# EAGLE design obstacle_avoiding_robot (EAGLE 6.1)
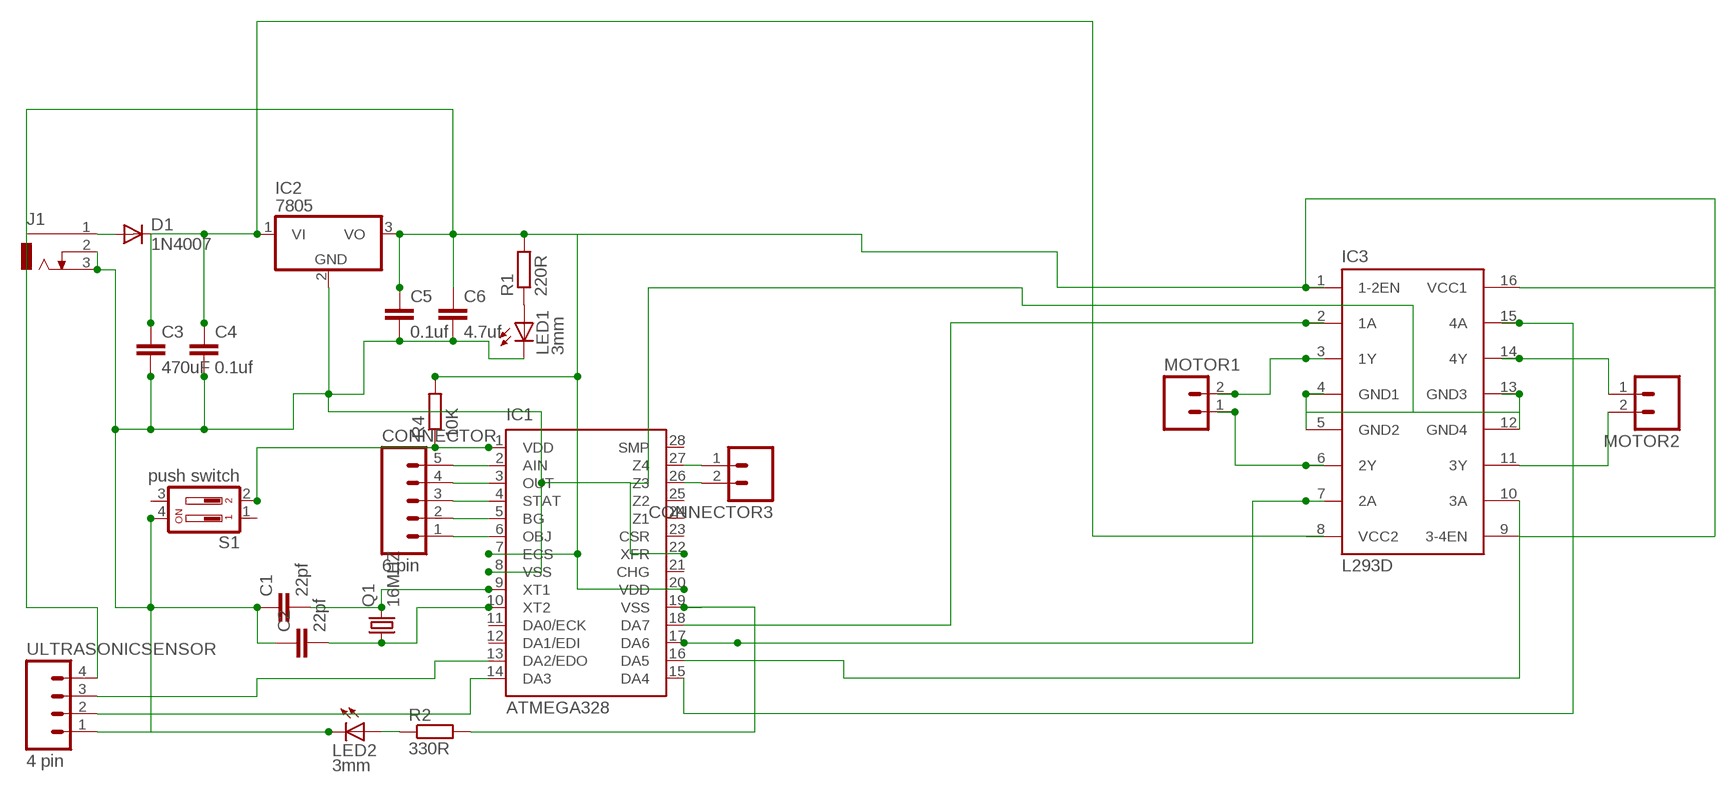
[diagram p0: schematic, sheet 1]

## Parts
C1  22pf  C2.5/2  [C2.5-2]
C2  22pf  C2.5/2  [C2.5-2]
C3  470uF  C2.5/2  [C2.5-2]
C4  0.1uf  C2.5/2  [C2.5-2]
C5  0.1uf  C2.5/2  [C2.5-2]
C6  4.7uf  C2.5/2  [C2.5-2]
CONNECTOR  6 pin  M05  [05P]
CONNECTOR3  M02  [02P]
D1  1N4007  1N4004  [DO41-10]
IC1  ATMEGA328  QT9701BD  [DIL28-3]
IC2  7805  786TV  [TO220V]
IC3  L293D  [DIL16]
J1  DCJ0303  [DCJ0303]
LED1  3mm  LED3MM  [LED3MM]
LED2  3mm  LED3MM  [LED3MM]
MOTOR1  M02  [02P]
MOTOR2  M02  [02P]
Q1  16MHZ  CRYSTALHC49S  [HC49/S]
R1  220R  R-EU_0207/10  [0207/10]
R2  330R  R-EU_0207/10  [0207/10]
R4  10K  R-EU_0207/10  [0207/10]
S1  push switch  DP02  [DP-02]
ULTRASONICSENSOR  4 pin  M04  [04P]

## Nets
N$1: C1.2 IC1.9(XT1) Q1.2
N$2: C2.2 IC1.10(XT2) Q1.1
N$3: D1.A J1.1
N$4: C3.1 C4.1 D1.C IC2.1(VI) IC3.8(VCC2)
N$5: C1.1 C2.1 C3.2 C4.2 C5.2 C6.2 IC1.8(VSS) IC1.22(XFR) IC2.2(GND) IC3.4(GND1) IC3.5(GND2) IC3.12(GND4) IC3.13(GND3) J1.2 J1.3 LED1.K(C) LED2.K(C) S1.4 ULTRASONICSENSOR.1
N$6: LED1.A R1.1
N$7: IC1.17(DA6) IC3.7(2A)
N$8: CONNECTOR.1 IC1.6(OBJ)
N$9: CONNECTOR.2 IC1.5(BG)
N$10: CONNECTOR.3 IC1.4(STAT)
N$11: CONNECTOR.4 IC1.3(OUT)
N$12: CONNECTOR3.1 IC1.27(Z4)
N$13: CONNECTOR3.2 IC1.26(Z3)
N$14: CONNECTOR.5 IC1.2(AIN)
N$15: IC1.18(DA7) IC3.2(1A)
N$16: IC1.15(DA4) IC3.15(4A)
N$17: IC1.13(DA2/EDO) ULTRASONICSENSOR.3
N$18: IC1.14(DA3) ULTRASONICSENSOR.2
N$21: IC1.16(DA5) IC3.10(3A)
N$25: IC3.14(4Y) MOTOR2.1
N$27: IC1.19(VSS) R2.2
N$28: IC3.11(3Y) MOTOR2.2
N$31: IC1.1(VDD) R4.1 S1.2
N$32: LED2.A R2.1
N$33: C5.1 C6.1 IC1.7(ECS) IC1.20(VDD) IC2.3(VO) IC3.1(1-2EN) IC3.9(3-4EN) IC3.16(VCC1) R1.2 R4.2 ULTRASONICSENSOR.4
N$34: IC3.6(2Y) MOTOR1.1
N$35: IC3.3(1Y) MOTOR1.2
Unconnected: IC1.11(DA0/ECK) IC1.12(DA1/EDI) IC1.21(CHG) IC1.23(CSR) IC1.24(Z1) IC1.25(Z2) IC1.28(SMP) S1.1 S1.3

## Library data of the parts
C1-C6 = capacitor-wima:C: CAPACITOR naming: grid - package width
CONNECTOR = con-amp-quick:M05: AMP QUICK CONNECTOR; OC_FARNELL: unknown; OC_NEWARK: unknown
CONNECTOR3 MOTOR1 MOTOR2 = con-amp-quick:M02: AMP QUICK CONNECTOR; OC_FARNELL: unknown; OC_NEWARK: unknown
D1 = diode:1N4004: DIODE general purpose rectifier, 1 A
IC1 = quantum-research-group:QT9701B: Charge-Transfer Capacitance Sensor IC Source: http://data.qprox.com/downloads/datasheets/qt9701b.pdf; OC_FARNELL: unknown; OC_NEWARK: unknown
IC2 = linear:78*: Positive VOLTAGE REGULATOR Source: http://cache.national.com/ds/LM/LM78L05.pdf http://www.fairchildsemi.com/ds/LM/LM7805.pdf
IC3 = st-microelectronics:L293D: PUSH-PULL 4 CHANNEL DRIVER; MPN: L293D; OC_FARNELL: 9589619; OC_NEWARK: 56P8249
J1 = con-jack:DCJ0303: DC POWER JACK Source: DCJ0303.pdf; OC_FARNELL: unknown; OC_NEWARK: unknown
LED1 LED2 = led:LED: LED OSRAM: - CHIPLED LG R971, LG N971, LY N971, LG Q971, LY Q971, LO R971, LY R971 LH N974, LH R974 LS Q976, LO Q976, LY Q976 LO Q996 - Hyper CHIPLED LW Q18S LB Q993, LB Q99A, LB R99A - SideLED LS A670, LO A670, LY A670, LG A670, LP A670 LB A673, LV A673, LT A673, LW A673 LH A674 LY A675 LS A676, LA A676, LO A676, LY A676, LW A676 LS A679, LY A679, LG A679 - Hyper Micro SIDELED® LS Y876, LA Y876, LO Y876, LY Y876 LT Y87S - SmartLED LW L88C, LW L88S LB L89C, LB L89S, LG L890 LS L89K, LO L89K, LY L89K LS L896, LA L896, LO L896, LY L896 - TOPLED LS T670, LO T670, LY T670, LG T670, LP T670 LSG T670, LSP T670, LSY T670, LOP T670, LYG T670 LG T671, LOG T671, LSG T671 LB T673, LV T673, LT T673, LW T673 LH T674 LS T676, LA T676, LO T676, LY T676, LB T676, LH T676, LSB T676, LW T676 LB T67C, LV T67C, LT T67C, LS T67K, LO T67K, LY T67K, LW E67C LS E67B, LA E67B, LO E67B, LY E67B, LB E67C, LV E67C, LT E67C LW T67C LS T679, LY T679, LG T679 LS T770, LO T770, LY T770, LG T770, LP T770 LB T773, LV T773, LT T773, LW T773 LH T774 LS E675, LA E675, LY E675, LS T675 LS T776, LA T776, LO T776, LY T776, LB T776 LHGB T686 LT T68C, LB T68C - Hyper Mini TOPLED® LB M676 - Mini TOPLED Santana® LG M470 LS M47K, LO M47K, LY M47K Source: http://www.osram.convergy.de LUXEON: - LUMILED® LXK2-PW12-R00, LXK2-PW12-S00, LXK2-PW14-U00, LXK2-PW14-V00 LXK2-PM12-R00, LXK2-PM12-S00, LXK2-PM14-U00 LXK2-PE12-Q00, LXK2-PE12-R00, LXK2-PE12-S00, LXK2-PE14-T00, LXK2-PE14-U00 LXK2-PB12-K00, LXK2-PB12-L00, LXK2-PB12-M00, LXK2-PB14-N00, LXK2-PB14-P00, LXK2-PB14-Q00 LXK2-PR12-L00, LXK2-PR12-M00, LXK2-PR14-Q00, LXK2-PR14-R00 LXK2-PD12-Q00, LXK2-PD12-R00, LXK2-PD12-S00 LXK2-PH12-R00, LXK2-PH12-S00 LXK2-PL12-P00, LXK2-PL12-Q00, LXK2-PL12-R00 Source: www.luxeon.com KINGBRIGHT: KA-3528ASYC Source: www.kingbright.com
Q1 = crystal:CRYSTAL: CRYSTAL; OC_FARNELL: 1667008; OC_NEWARK: unknown
R1 R2 R4 = rcl:R-EU_: RESISTOR, European symbol
S1 = switch-dil:DP02: DIL/CODE SWITCH; MPN: MCDP02; OC_FARNELL: 1255233; OC_NEWARK: 26M1095
ULTRASONICSENSOR = con-amp-quick:M04: AMP QUICK CONNECTOR; OC_FARNELL: unknown; OC_NEWARK: unknown

## Board
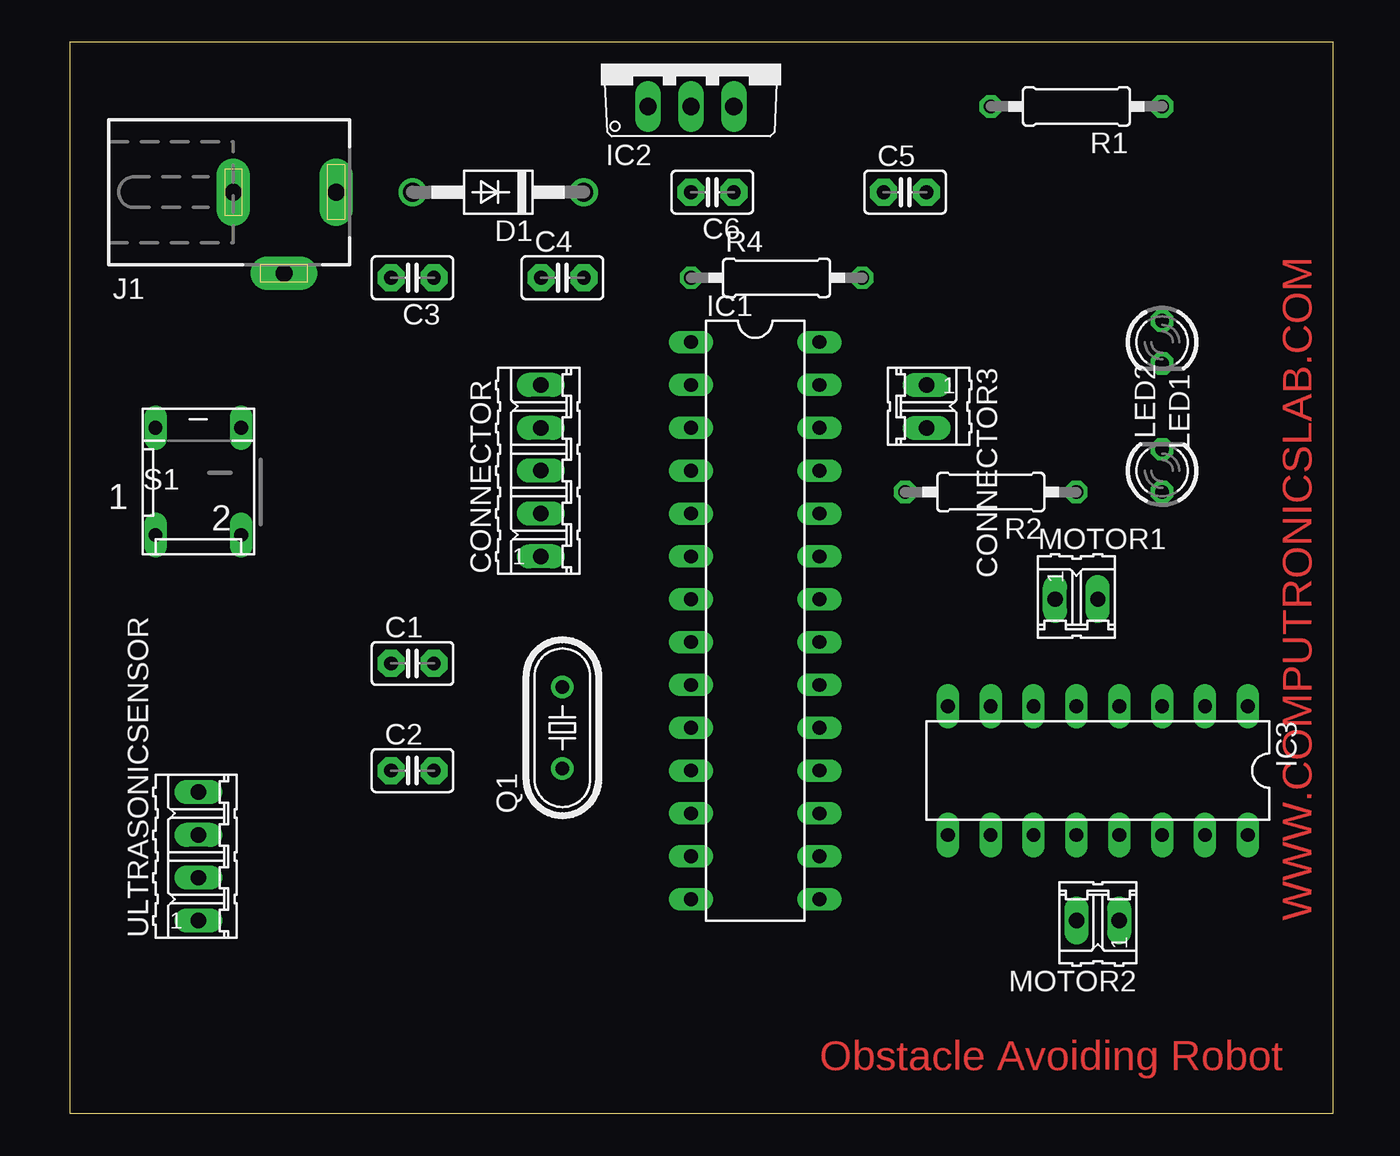
[diagram p1: board, top side]
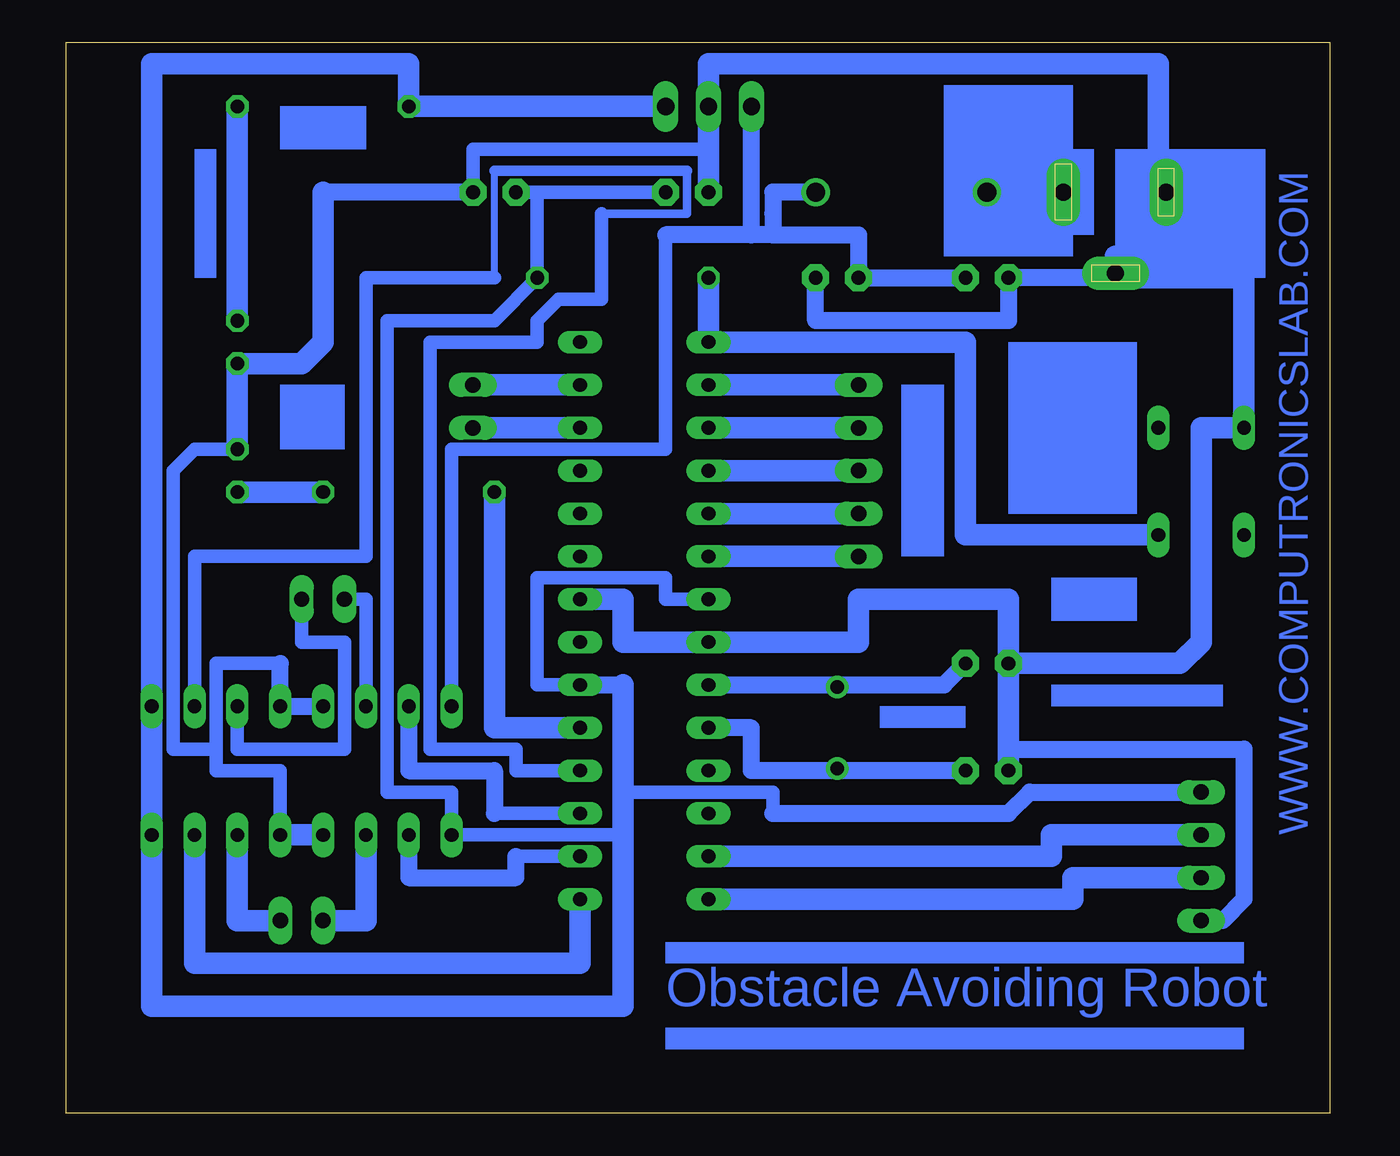
[diagram p2: board, bottom side, seen from below]

Size 74.93 x 63.49 mm. Coordinates in mm from the lower left corner, seen from the top.
Outline: 0,0 74.93,0 74.93,63.49 0,63.49 0,0
Copper layers (1*16): Top 0.035mm / dielectric 1.5mm / Bottom 0.035mm
Design rules: minimum track width 15mil, minimum drill 24mil, track to track 8mil, track to pad 8mil, pad to pad 8mil, via to via 8mil, smd to smd 8mil, copper to edge 40mil, drill to drill 8mil, minimum pad ring 10mil, minimum via ring 8mil, stop-mask expansion 4mil, vias tented up to drill 0mil, thermal gap 10mil

### Footprints (pad centres in the part's own frame; a part is rotated, then mirrored left to right if it is on the bottom)
C2.5-2 = drill 0.813 pad 1.6 octagon: 1 -1.27,0; 2 1.27,0
05P = drill 0.914 long: 1 -5.08,0; 2 -2.54,0; 3 0,0; 4 2.54,0; 5 5.08,0
02P = drill 0.914 long: 1 -1.27,0; 2 1.27,0
DO41-10 = drill 1.118: A 5.08,0; C -5.08,0
DIL28-3 = drill 0.813 long: 1 -16.51,-3.81; 2 -13.97,-3.81; 3 -11.43,-3.81; 4 -8.89,-3.81; 5 -6.35,-3.81; 6 -3.81,-3.81; 7 -1.27,-3.81; 8 1.27,-3.81; 9 3.81,-3.81; 10 6.35,-3.81; 11 8.89,-3.81; 12 11.43,-3.81; 13 13.97,-3.81; 14 16.51,-3.81; 15 16.51,3.81; 16 13.97,3.81; 17 11.43,3.81; 18 8.89,3.81; 19 6.35,3.81; 20 3.81,3.81; 21 1.27,3.81; 22 -1.27,3.81; 23 -3.81,3.81; 24 -6.35,3.81; 25 -8.89,3.81; 26 -11.43,3.81; 27 -13.97,3.81; 28 -16.51,3.81
TO220V = drill 1.016 long: 1 -2.54,-2.54; 2 0,-2.54; 3 2.54,-2.54
DIL16 = drill 0.813 long: 1 -8.89,-3.81; 2 -6.35,-3.81; 3 -3.81,-3.81; 4 -1.27,-3.81; 5 1.27,-3.81; 6 3.81,-3.81; 7 6.35,-3.81; 8 8.89,-3.81; 9 8.89,3.81; 10 6.35,3.81; 11 3.81,3.81; 12 1.27,3.81; 13 -1.27,3.81; 14 -3.81,3.81; 15 -6.35,3.81; 16 -8.89,3.81
DCJ0303 = drill 1 pad 2 long: 1 0,3.1; 2 4.8,0; 3 0,-3
LED3MM = drill 0.813 octagon: A -1.27,0; K 1.27,0
HC49/S = drill 0.813: 1 -2.413,0; 2 2.413,0
0207/10 = drill 0.813 octagon: 1 -5.08,0; 2 5.08,0
DP-02 = drill 0.813 long: 1 -2.54,-2.54; 2 2.54,-2.54; 3 2.54,3.81; 4 -2.54,3.81
04P = drill 0.914 long: 1 -3.81,0; 2 -1.27,0; 3 1.27,0; 4 3.81,0

### Placement (x,y rotation side)
C1  20.32,26.67 0 top
C2  20.32,20.32 0 top
C3  20.32,49.53 180 top
C4  29.21,49.53 0 top
C5  49.53,54.61 0 top
C6  38.1,54.61 180 top
CONNECTOR  27.94,38.1 90 top
CONNECTOR3  50.8,41.91 270 top
D1  25.4,54.61 180 top
IC1  40.64,29.21 270 top
IC2  36.83,62.23 0 top
IC3  60.96,20.32 180 top
J1  12.7,54.61 270 top
LED1  64.77,45.72 270 top
LED2  64.77,38.1 90 top
MOTOR1  59.69,30.48 0 top
MOTOR2  60.96,11.43 180 top
Q1  29.21,22.86 90 top
R1  59.69,59.69 180 top
R2  54.61,36.83 180 top
R4  41.91,49.53 0 top
S1  7.62,36.83 0 top
ULTRASONICSENSOR  7.62,15.24 90 top

### Tracks (layer width: path | path; a pad name or v marks a point on that pad's centre or on a via)
N$1
  Bottom 0.381: 29.21,25.4 Q1.2
  Bottom 1.016: IC1.9 29.21,25.4 22.86,25.4 C1.2
N$2
  Bottom 0.381: 29.21,20.32 Q1.1
  Bottom 1.016: C2.2 29.21,20.32 34.29,20.32 34.29,22.86 IC1.10
N$3
  Bottom 1.016: J1.1 D1.A
N$4
  Bottom 0.813: IC3.8 52.07,39.37 43.18,39.37 39.37,39.37 39.37,43.18 39.37,52.07
  Bottom 1.016: C3.1 C4.1 27.94,52.07 33.02,52.07 | 33.02,52.07 34.29,52.07 | 34.29,52.07 39.37,52.07 | D1.C 33.02,54.61 33.02,53.34 33.02,52.07 | 34.29,52.07 IC2.1
N$5
  Bottom 0.381: 12.7,49.53 J1.2
  Bottom 0.813: IC3.13 62.23,20.32 66.04,20.32 66.04,21.59 | 66.04,21.59 66.04,26.67 62.23,26.67 | C5.2 50.8,57.15 36.83,57.15 | 66.04,21.59 68.58,21.59 68.58,38.1 67.31,39.37 LED2.K
  Bottom 1.016: ULTRASONICSENSOR.1 6.35,11.43 5.08,12.7 5.08,21.59 19.05,21.59 C2.1 | 12.7,49.53 C3.2 19.05,46.99 30.48,46.99 C4.2 | IC3.5 IC3.4 62.23,26.67 | C5.2 59.69,54.61
  Bottom 1.27: IC1.22 41.91,30.48 41.91,27.94 IC1.8 27.94,27.94 27.94,30.48 19.05,30.48 C1.1 | C1.1 C2.1 | 12.7,49.53 5.08,49.53 S1.4 7.62,40.64 7.62,27.94 8.89,26.67 C1.1 | 10.16,54.61 10.16,50.8 12.7,50.8 J1.2 | IC3.13 IC3.12 | LED2.K LED1.K 60.96,44.45 59.69,45.72 59.69,54.61 | C6.2 36.83,57.15 IC2.2 36.83,62.23 10.16,62.23 10.16,54.61 | 10.16,54.61 J1.3
N$6
  Bottom 1.27: R1.1 LED1.A
N$7
  Bottom 0.813: 49.53,17.78 IC1.17
  Bottom 1.016: 49.53,17.78 49.53,20.32 54.61,20.32 IC3.7
N$8
  Bottom 1.27: CONNECTOR.1 IC1.6
N$9
  Bottom 1.27: CONNECTOR.2 IC1.5
N$10
  Bottom 1.27: CONNECTOR.3 IC1.4
N$11
  Bottom 1.27: CONNECTOR.4 IC1.3
N$12
  Bottom 1.27: CONNECTOR3.1 IC1.27
N$13
  Bottom 1.27: CONNECTOR3.2 IC1.26
N$14
  Bottom 1.27: CONNECTOR.5 IC1.2
N$15
  Bottom 0.406: 49.53,49.53 49.53,55.88
  Bottom 0.508: 43.18,53.34 38.1,53.34 38.1,55.88
  Bottom 0.61: 49.53,55.88 38.1,55.88
  Bottom 0.813: IC1.18 48.26,20.32 48.26,21.59 53.34,21.59 53.34,45.72 46.99,45.72 46.99,46.99 45.72,48.26 43.18,48.26 43.18,53.34 | 49.53,49.53 50.8,49.53 57.15,49.53 57.15,33.02 67.31,33.02 IC3.2
N$16
  Bottom 1.27: IC1.15 44.45,10.16 44.45,8.89 48.26,8.89 63.5,8.89 67.31,8.89 67.31,12.7 IC3.15
N$17
  Bottom 1.27: IC1.13 16.51,15.24 16.51,16.51 ULTRASONICSENSOR.3
N$18
  Bottom 1.27: IC1.14 15.24,12.7 15.24,13.97 ULTRASONICSENSOR.2
N$21
  Bottom 0.813: 48.26,15.24 IC1.16
  Bottom 1.016: 48.26,15.24 48.26,13.97 54.61,13.97 IC3.10
N$25
  Bottom 1.27: IC3.14 64.77,11.43 MOTOR2.1
N$27
  Bottom 1.27: IC1.19 49.53,22.86 R2.2
N$28
  Bottom 1.27: IC3.11 57.15,11.43 MOTOR2.2
N$31
  Bottom 1.27: S1.2 21.59,34.29 21.59,45.72 IC1.1 R4.1
N$32
  Bottom 1.27: LED2.A R2.1
N$33
  Bottom 0.813: 46.99,54.61 R4.2 49.53,46.99 55.88,46.99 55.88,19.05 52.07,19.05 IC3.9 41.91,16.51 | C5.1 46.99,54.61 | 46.99,54.61 C6.1 | IC1.7 39.37,30.48 39.37,31.75 46.99,31.75 46.99,25.4 IC1.20 | 41.91,19.05 33.02,19.05 33.02,17.78
  Bottom 1.016: IC1.20 41.91,25.4 | 33.02,17.78 19.05,17.78 17.78,19.05 ULTRASONICSENSOR.4
  Bottom 1.27: IC2.3 R1.2 54.61,62.23 69.85,62.23 IC3.1 IC3.16 69.85,6.35 41.91,6.35 41.91,16.51 41.91,19.05 41.91,25.4
N$34
  Bottom 0.813: IC3.6 57.15,30.48 MOTOR1.1
N$35
  Bottom 0.813: IC3.3 64.77,21.59 62.23,21.59 59.69,21.59 58.42,21.59 58.42,22.86 58.42,27.94 60.96,27.94 MOTOR1.2
(copper drawn outside any net)
  shapes: Bottom area x14

### Text on the board
Top: WWW.COMPUTRONICSLAB.COM | Obstacle Avoiding Robot
Bottom: WWW.COMPUTRONICSLAB.COM | Obstacle Avoiding Robot